# EAGLE design Layout_LEDs_Chris (EAGLE 4.16)
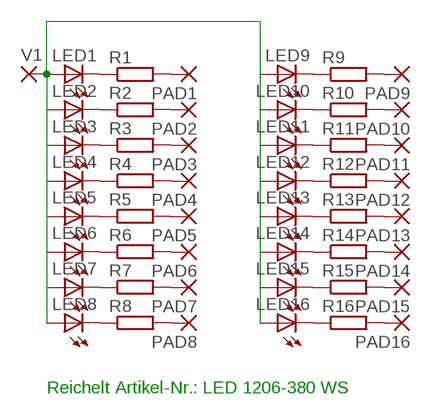
[diagram p0: schematic, sheet 1]

## Parts
LED1  LEDCHIPLED_1206  [CHIPLED_1206]
LED2  LEDCHIPLED_1206  [CHIPLED_1206]
LED3  LEDCHIPLED_1206  [CHIPLED_1206]
LED4  LEDCHIPLED_1206  [CHIPLED_1206]
LED5  LEDCHIPLED_1206  [CHIPLED_1206]
LED6  LEDCHIPLED_1206  [CHIPLED_1206]
LED7  LEDCHIPLED_1206  [CHIPLED_1206]
LED8  LEDCHIPLED_1206  [CHIPLED_1206]
LED9  LEDCHIPLED_1206  [CHIPLED_1206]
LED10  LEDCHIPLED_1206  [CHIPLED_1206]
LED11  LEDCHIPLED_1206  [CHIPLED_1206]
LED12  LEDCHIPLED_1206  [CHIPLED_1206]
LED13  LEDCHIPLED_1206  [CHIPLED_1206]
LED14  LEDCHIPLED_1206  [CHIPLED_1206]
LED15  LEDCHIPLED_1206  [CHIPLED_1206]
LED16  LEDCHIPLED_1206  [CHIPLED_1206]
PAD1  3,81/1,1  [3,81/1,1]
PAD2  3,81/1,1  [3,81/1,1]
PAD3  3,81/1,1  [3,81/1,1]
PAD4  3,81/1,1  [3,81/1,1]
PAD5  3,81/1,1  [3,81/1,1]
PAD6  3,81/1,1  [3,81/1,1]
PAD7  3,81/1,1  [3,81/1,1]
PAD8  3,81/1,1  [3,81/1,1]
PAD9  3,81/1,1  [3,81/1,1]
PAD10  3,81/1,1  [3,81/1,1]
PAD11  3,81/1,1  [3,81/1,1]
PAD12  3,81/1,1  [3,81/1,1]
PAD13  3,81/1,1  [3,81/1,1]
PAD14  3,81/1,1  [3,81/1,1]
PAD15  3,81/1,1  [3,81/1,1]
PAD16  3,81/1,1  [3,81/1,1]
R1  R-EU_MELF0207W  [MINI_MELF-0207W]
R2  R-EU_MELF0207W  [MINI_MELF-0207W]
R3  R-EU_MELF0207W  [MINI_MELF-0207W]
R4  R-EU_MELF0207W  [MINI_MELF-0207W]
R5  R-EU_MELF0207W  [MINI_MELF-0207W]
R6  R-EU_MELF0207W  [MINI_MELF-0207W]
R7  R-EU_MELF0207W  [MINI_MELF-0207W]
R8  R-EU_MELF0207W  [MINI_MELF-0207W]
R9  R-EU_MELF0207W  [MINI_MELF-0207W]
R10  R-EU_MELF0207W  [MINI_MELF-0207W]
R11  R-EU_MELF0207W  [MINI_MELF-0207W]
R12  R-EU_MELF0207W  [MINI_MELF-0207W]
R13  R-EU_MELF0207W  [MINI_MELF-0207W]
R14  R-EU_MELF0207W  [MINI_MELF-0207W]
R15  R-EU_MELF0207W  [MINI_MELF-0207W]
R16  R-EU_MELF0207W  [MINI_MELF-0207W]
V1  3,81/1,1  [3,81/1,1]

## Nets
N$1: LED1.C R1.1
N$2: LED2.C R2.1
N$3: LED3.C R3.1
N$4: LED4.C R4.1
N$5: LED5.C R5.1
N$6: LED6.C R6.1
N$7: LED7.C R7.1
N$8: LED8.C R8.1
N$9: LED9.C R9.1
N$10: LED10.C R10.1
N$11: LED11.C R11.1
N$12: LED12.C R12.1
N$13: LED13.C R13.1
N$14: LED14.C R14.1
N$15: LED15.C R15.1
N$16: LED16.C R16.1
N$17: LED1.A LED2.A LED3.A LED4.A LED5.A LED6.A LED7.A LED8.A LED9.A LED10.A LED11.A LED12.A LED13.A LED14.A LED15.A LED16.A V1.1(P)
N$19: PAD1.1(P) R1.2
N$20: PAD2.1(P) R2.2
N$21: PAD3.1(P) R3.2
N$22: PAD4.1(P) R4.2
N$23: PAD5.1(P) R5.2
N$24: PAD6.1(P) R6.2
N$25: PAD7.1(P) R7.2
N$26: PAD8.1(P) R8.2
N$27: PAD9.1(P) R9.2
N$28: PAD10.1(P) R10.2
N$29: PAD11.1(P) R11.2
N$30: PAD12.1(P) R12.2
N$31: PAD13.1(P) R13.2
N$32: PAD14.1(P) R14.2
N$33: PAD15.1(P) R15.2
N$34: PAD16.1(P) R16.2

## Notes on the sheet
- Reichelt Artikel-Nr.: LED 1206-380 WS

## Library data of the parts
LED1-LED16 = led:LED: LED OSRAM: - CHIPLED LG R971, LG N971, LY N971, LG Q971, LY Q971, LO R971, LY R971 LH N974, LH R974 LS Q976, LO Q976, LY Q976 LO Q996 - Hyper CHIPLED LW Q18S LB Q993, LB Q99A, LB R99A - SideLED LS A670, LO A670, LY A670, LG A670, LP A670 LB A673, LV A673, LT A673, LW A673 LH A674 LY A675 LS A676, LA A676, LO A676, LY A676, LW A676 LS A679, LY A679, LG A679 - Hyper Micro SIDELED® LS Y876, LA Y876, LO Y876, LY Y876 LT Y87S - SmartLED LW L88C, LW L88S LB L89C, LB L89S, LG L890 LS L89K, LO L89K, LY L89K LS L896, LA L896, LO L896, LY L896 - TOPLED LS T670, LO T670, LY T670, LG T670, LP T670 LSG T670, LSP T670, LSY T670, LOP T670, LYG T670 LG T671, LOG T671, LSG T671 LB T673, LV T673, LT T673, LW T673 LH T674 LS T676, LA T676, LO T676, LY T676, LB T676, LH T676, LSB T676, LW T676 LB T67C, LV T67C, LT T67C, LS T67K, LO T67K, LY T67K, LW E67C LS E67B, LA E67B, LO E67B, LY E67B, LB E67C, LV E67C, LT E67C LW T67C LS T679, LY T679, LG T679 LS T770, LO T770, LY T770, LG T770, LP T770 LB T773, LV T773, LT T773, LW T773 LH T774 LS E675, LA E675, LY E675, LS T675 LS T776, LA T776, LO T776, LY T776, LB T776 LHGB T686 LT T68C, LB T68C - Hyper Mini TOPLED® LB M676 - Mini TOPLED Santana® LG M470 LS M47K, LO M47K, LY M47K Source: http://www.osram.convergy.de/
PAD1-PAD16 V1 = wirepad:3,81/1,1: THROUGH-HOLE PAD
R1-R16 = rcl:R-EU_: RESISTOR, European symbol

## Board
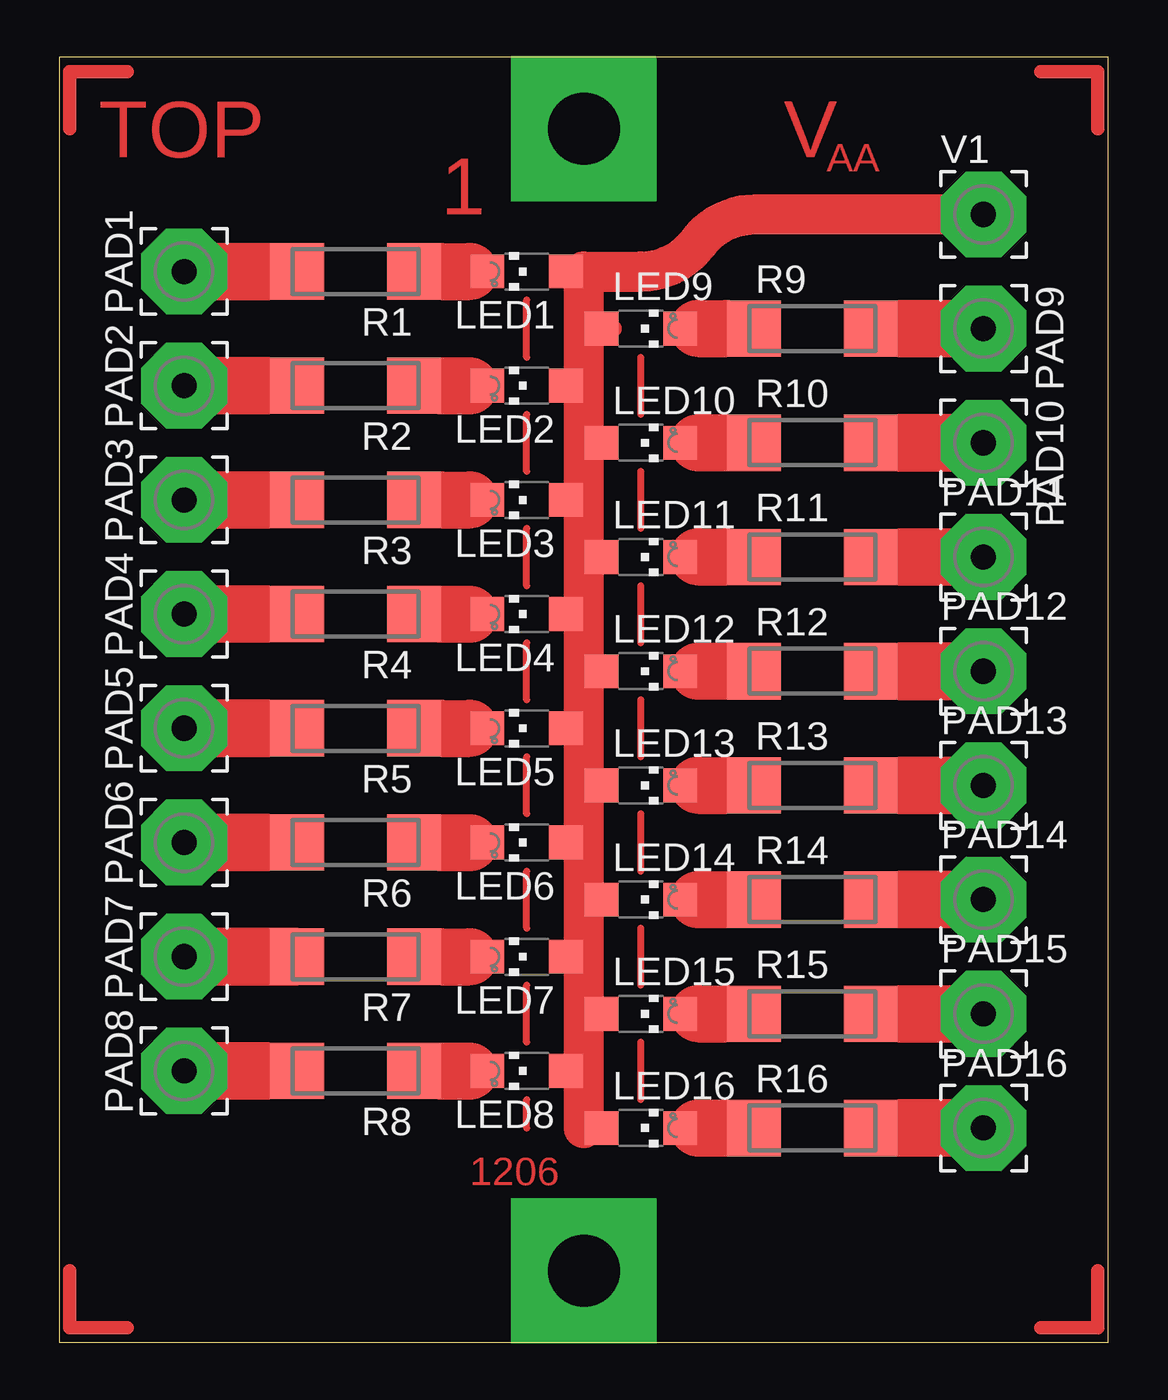
[diagram p1: board, top side]

Size 46.66 x 57.14 mm. Coordinates in mm from the lower left corner, seen from the top.
Outline: 0,0 46.66,0 46.66,57.14 0,57.14 0,0
Copper layers (1*16): Top 0.035mm / dielectric 1.5mm / Bottom 0.035mm
Design rules "default": minimum track width 10mil, minimum drill 24mil, track to track 8mil, track to pad 8mil, pad to pad 8mil, via to via 8mil, smd to smd 8mil, copper to edge 40mil, drill to drill 8mil, minimum pad ring 10mil, minimum via ring 8mil, stop-mask expansion 4mil, vias tented up to drill 0mil, thermal gap 10mil

### Footprints (pad centres in the part's own frame; a part is rotated, then mirrored left to right if it is on the bottom)
CHIPLED_1206 = smd 1.5 x 1.5: A 0,-1.75; C 0,1.75
3,81/1,1 = drill 1.118 pad 3.81 octagon: 1 0,0
MINI_MELF-0207W = smd 2.4 x 2.5: 1 -2.6,0; 2 2.6,0

### Placement (x,y rotation side)
LED1  20.79,47.62 90 top
LED2  20.79,42.54 90 top
LED3  20.79,37.46 90 top
LED4  20.79,32.38 90 top
LED5  20.79,27.3 90 top
LED6  20.79,22.22 90 top
LED7  20.79,17.14 90 top
LED8  20.79,12.06 90 top
LED9  25.87,45.08 270 top
LED10  25.87,40 270 top
LED11  25.87,34.92 270 top
LED12  25.87,29.84 270 top
LED13  25.87,24.76 270 top
LED14  25.87,19.68 270 top
LED15  25.87,14.6 270 top
LED16  25.87,9.52 270 top
PAD1  5.55,47.62 90 top
PAD2  5.55,42.54 90 top
PAD3  5.55,37.46 90 top
PAD4  5.55,32.38 90 top
PAD5  5.55,27.3 90 top
PAD6  5.55,22.22 90 top
PAD7  5.55,17.14 90 top
PAD8  5.55,12.06 90 top
PAD9  41.11,45.08 270 top
PAD10  41.11,40 270 top
PAD11  41.11,34.92 0 top
PAD12  41.11,29.84 0 top
PAD13  41.11,24.76 0 top
PAD14  41.11,19.68 0 top
PAD15  41.11,14.6 0 top
PAD16  41.11,9.52 0 top
R1  13.17,47.62 180 top
R2  13.17,42.54 180 top
R3  13.17,37.46 180 top
R4  13.17,32.38 180 top
R5  13.17,27.3 180 top
R6  13.17,22.22 180 top
R7  13.17,17.14 180 top
R8  13.17,12.06 180 top
R9  33.49,45.08 0 top
R10  33.49,40 0 top
R11  33.49,34.92 0 top
R12  33.49,29.84 0 top
R13  33.49,24.76 0 top
R14  33.49,19.68 0 top
R15  33.49,14.6 0 top
R16  33.49,9.52 0 top
V1  41.11,50.16 0 top

### Tracks (layer width: path | path; a pad name or v marks a point on that pad's centre or on a via)
N$1
  Top 0.254: 16.98,47.62 R1.1 15.71,47.62 | 18.25,47.62 LED1.C 19.52,47.62
  Top 2.54: 16.98,47.62 18.25,47.62
N$2
  Top 0.254: 16.98,42.54 R2.1 15.71,42.54 | 18.25,42.54 LED2.C 19.52,42.54
  Top 2.54: 16.98,42.54 18.25,42.54
N$3
  Top 0.254: 16.98,37.46 R3.1 15.71,37.46 | 18.25,37.46 LED3.C 19.52,37.46
  Top 2.54: 16.98,37.46 18.25,37.46
N$4
  Top 0.254: 16.98,32.38 R4.1 15.71,32.38 | 18.25,32.38 LED4.C 19.52,32.38
  Top 2.54: 16.98,32.38 18.25,32.38
N$5
  Top 0.254: 16.98,27.3 R5.1 15.71,27.3 | 18.25,27.3 LED5.C 19.52,27.3
  Top 2.54: 16.98,27.3 18.25,27.3
N$6
  Top 0.254: 16.98,22.22 R6.1 15.71,22.22 | 18.25,22.22 LED6.C 19.52,22.22
  Top 2.54: 16.98,22.22 18.25,22.22
N$7
  Top 0.254: 16.98,17.14 R7.1 15.71,17.14 | 18.25,17.14 LED7.C 19.52,17.14
  Top 2.54: 16.98,17.14 18.25,17.14
N$8
  Top 0.254: 16.98,12.06 R8.1 15.71,12.06 | 18.25,12.06 LED8.C 19.52,12.06
  Top 2.54: 16.98,12.06 18.25,12.06
N$9
  Top 0.254: 28.41,45.08 LED9.C 27.14,45.08 | 29.68,45.08 R9.1 30.95,45.08
  Top 2.54: 28.41,45.08 29.68,45.08
N$10
  Top 0.254: 28.41,40 LED10.C 27.14,40 | 29.68,40 R10.1 30.95,40
  Top 2.54: 28.41,40 29.68,40
N$11
  Top 0.254: 28.41,34.92 LED11.C 27.14,34.92 | 29.68,34.92 R11.1 30.95,34.92
  Top 2.54: 28.41,34.92 29.68,34.92
N$12
  Top 0.254: 28.41,29.84 LED12.C 27.14,29.84 | 29.68,29.84 R12.1 30.95,29.84
  Top 2.54: 28.41,29.84 29.68,29.84
N$13
  Top 0.254: 28.41,24.76 LED13.C 27.14,24.76 | 29.68,24.76 R13.1 30.95,24.76
  Top 2.54: 28.41,24.76 29.68,24.76
N$14
  Top 0.254: 28.41,19.68 LED14.C 27.14,19.68 | 29.68,19.68 R14.1 30.95,19.68
  Top 2.54: 28.41,19.68 29.68,19.68
N$15
  Top 0.254: 28.41,14.6 LED15.C 27.14,14.6 | 29.68,14.6 R15.1 30.95,14.6
  Top 2.54: 28.41,14.6 29.68,14.6
N$16
  Top 0.254: 28.41,9.52 LED16.C 27.14,9.52 | 29.68,9.52 R16.1 30.95,9.52
  Top 2.54: 28.41,9.52 29.68,9.52
N$17
  Top 0.254: 23.33,12.06 LED8.A 22.06,12.06 | 24.6,45.08 LED9.A | 23.33,17.14 LED7.A 22.06,17.14 | 23.33,22.22 LED6.A 22.06,22.22 | 23.33,27.3 LED5.A 22.06,27.3 | 23.33,32.38 LED4.A 22.06,32.38 | 23.33,37.46 LED3.A 22.06,37.46 | 23.33,42.54 LED2.A 22.06,42.54 | 23.33,47.62 LED1.A 22.06,47.62 | 23.33,9.52 LED16.A 24.6,9.52 | 23.33,14.6 LED15.A 24.6,14.6 | 23.33,19.68 LED14.A 24.6,19.68 | 23.33,24.76 LED13.A 24.6,24.76 | 23.33,29.84 LED12.A 24.6,29.84 | 23.33,34.92 LED11.A 24.6,34.92 | 23.33,40 LED10.A 24.6,40
  Top 0.813: 23.33,45.08 24.6,45.08
  Top 1.778: 23.33,9.52 23.33,12.06 23.33,14.6 23.33,17.14 23.33,19.68 23.33,22.22 23.33,24.76 23.33,27.3 23.33,29.84 23.33,32.38 23.33,34.92 23.33,37.46 23.33,40 23.33,42.54 23.33,45.08 23.33,47.62 25.87,47.62 arc53 28.41,48.89 arc-53 30.95,50.16 V1.1
N$18  (via drill 3.2 pad 6.45)
  other vias: 23.33,53.97
N$19
  Top 0.254: 10.63,47.62 R1.2 PAD1.1
N$20
  Top 0.254: 10.63,42.54 R2.2 PAD2.1
N$21
  Top 0.254: 10.63,37.46 R3.2 PAD3.1
N$22
  Top 0.254: 10.63,32.38 R4.2 PAD4.1
N$23
  Top 0.254: 10.63,27.3 R5.2 PAD5.1
N$24
  Top 0.254: 10.63,22.22 R6.2 PAD6.1
N$25
  Top 0.254: 10.63,17.14 R7.2 PAD7.1
N$26
  Top 0.254: 10.63,12.06 R8.2 PAD8.1
N$27
  Top 0.254: 36.03,45.08 R9.2 PAD9.1
N$28
  Top 0.254: 36.03,40 R10.2 PAD10.1
N$29
  Top 0.254: 36.03,34.92 R11.2 PAD11.1
N$30
  Top 0.254: 36.03,29.84 R12.2 PAD12.1
N$31
  Top 0.254: 36.03,24.76 R13.2 PAD13.1
N$32
  Top 0.254: 36.03,19.68 R14.2 PAD14.1
N$33
  Top 0.254: 36.03,14.6 R15.2 PAD15.1
N$34
  Top 0.254: 36.03,9.52 R16.2 PAD16.1
N$35  (via drill 3.2 pad 6.45)
  other vias: 23.33,3.17
N$36
  Top 0.61: 0.47,53.97 0.47,56.51 3.01,56.51
N$37
  Top 0.61: 0.47,3.17 0.47,0.63 3.01,0.63
N$38
  Top 0.61: 43.65,0.63 46.19,0.63 46.19,3.17
N$39
  Top 0.61: 43.65,56.51 46.19,56.51 46.19,53.97
N$40
  Top 0.305: 20.79,43.81 20.79,46.35
N$41
  Top 0.305: 20.79,38.73 20.79,41.27
N$42
  Top 0.305: 20.79,33.65 20.79,36.19
N$43
  Top 0.305: 20.79,28.57 20.79,31.11
N$44
  Top 0.305: 25.87,41.27 25.87,43.81
N$45
  Top 0.305: 25.87,36.19 25.87,38.73
N$46
  Top 0.305: 25.87,31.11 25.87,33.65
N$47
  Top 0.305: 25.87,26.03 25.87,28.57
N$48
  Top 0.305: 25.87,20.95 25.87,23.49
N$49
  Top 0.305: 20.79,23.49 20.79,26.03
N$50
  Top 0.305: 20.79,18.41 20.79,20.95
N$51
  Top 0.305: 25.87,15.87 25.87,18.41
N$52
  Top 0.305: 20.79,13.33 20.79,15.87
N$53
  Top 0.305: 25.87,10.79 25.87,13.33
N$54
  Top 0.305: 20.79,9.52 20.79,10.79
(copper drawn outside any net)
  shapes: Top area x16

### Text on the board
Top: TOP | V | AA | 1 | 1206